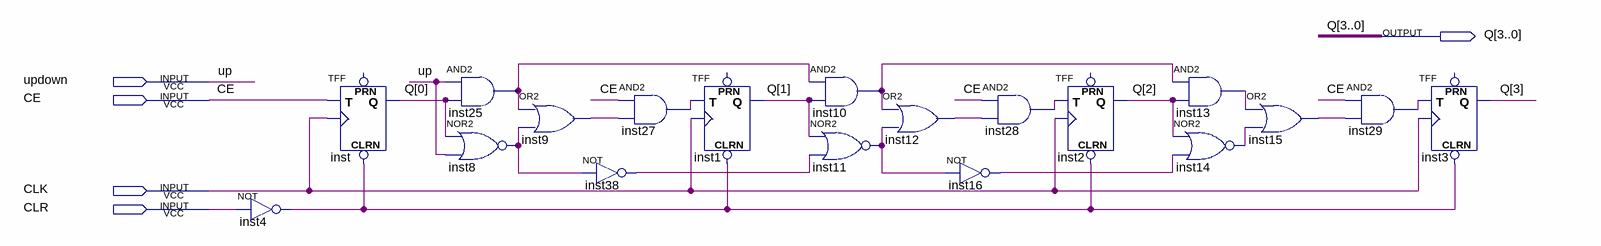
[diagram p0: schematic sheet]
// Quartus schematic counter.bdf as structural Verilog: 19 symbols, 5 pins
module counter (
  input  updown,
  input  CE,
  input  CLK,
  input  CLR,
  output [3:0] Q
);

  wire inst4_out, inst8_out, inst9_out, inst10_out, inst11_out, inst12_out, inst13_out, inst14_out,
       inst15_out, inst16_out, inst25_out, inst27_out, inst28_out, inst29_out, inst38_out;

  not inst4 (inst4_out, CLR);
  TFF inst (.CLRN(inst4_out), .T(CE), .CLK(CLK), .Q(Q[0]));  // open: PRN
  and inst25 (inst25_out, updown, Q[0]);
  nor inst8 (inst8_out, Q[0], updown);
  or inst9 (inst9_out, inst25_out, inst8_out);
  and inst27 (inst27_out, CE, inst9_out);
  not inst38 (inst38_out, inst8_out);
  TFF inst1 (.CLRN(inst4_out), .T(inst27_out), .CLK(CLK), .Q(Q[1]));  // open: PRN
  and inst10 (inst10_out, inst25_out, Q[1]);
  nor inst11 (inst11_out, Q[1], inst38_out);
  or inst12 (inst12_out, inst10_out, inst11_out);
  and inst28 (inst28_out, CE, inst12_out);
  not inst16 (inst16_out, inst11_out);
  TFF inst2 (.CLRN(inst4_out), .T(inst28_out), .CLK(CLK), .Q(Q[2]));  // open: PRN
  and inst13 (inst13_out, inst10_out, Q[2]);
  nor inst14 (inst14_out, Q[2], inst16_out);
  or inst15 (inst15_out, inst13_out, inst14_out);
  and inst29 (inst29_out, CE, inst15_out);
  TFF inst3 (.CLRN(inst4_out), .T(inst29_out), .CLK(CLK), .Q(Q[3]));  // open: PRN

  // Other names for the same wires on the sheet: up = updown
endmodule
